# EAGLE schematic midi2cv (EAGLE 9.6.1)
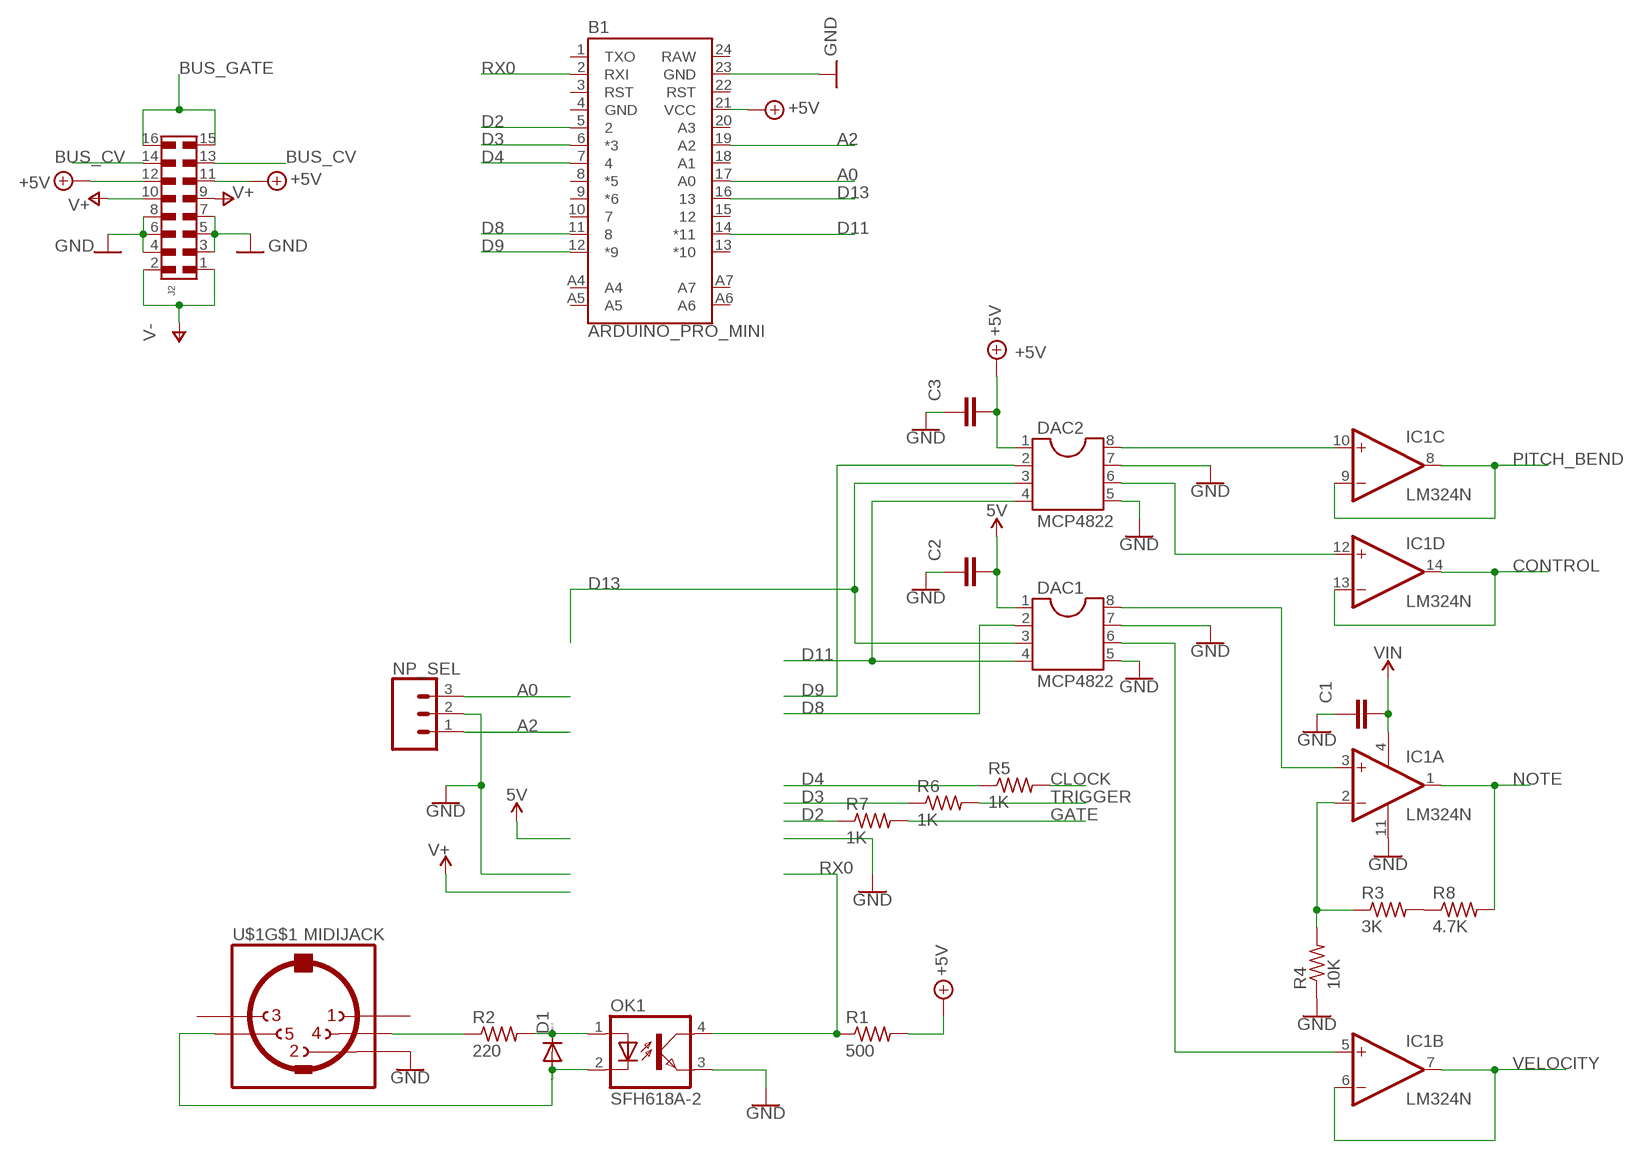
[diagram p0: schematic, sheet 1]

## Parts
B1  ARDUINO_PRO_MINI  [ARDUINO_PRO_MINI]
C1  0.1uF  C2.5/4  [C2.5-4]
C2  0.1uF  C2.5/4  [C2.5-4]
C3  0.1uF  C2.5/4  [C2.5-4]
D1  DIODE-D-10  [D-10]
DAC1  MCP4822  DIL8S  [SOCKET-08]
DAC2  MCP4822  DIL8S  [SOCKET-08]
IC1  LM324N  [DIL14]
J2  6120XX20621_61201620621  [61201620621]
NP_SEL  CONN_03  [1X03]
OK1  SFH618A-2  [DIP4]
R1  500  R-US_0207/10  [0207/10]
R2  220  R-US_0207/10  [0207/10]
R3  3K  R-US_0207/10  [0207/10]
R4  10K  R-US_0207/10  [0207/10]
R5  1K  R-US_0207/10  [0207/10]
R6  1K  R-US_0207/10  [0207/10]
R7  1K  R-US_0207/10  [0207/10]
R8  4.7K  R-US_0207/10  [0207/10]
U$1  MIDIJACK  [CP-2350]

## Nets
+5V: B1.21(VCC) C2.2 C3.2 DAC1.1 DAC2.1 J2.11 J2.12 R1.2 ; supply symbol labelled 5V
A0: B1.17(A0) NP_SEL.3
A2: B1.19(A2) NP_SEL.1
BUS_CV: J2.13 J2.14
BUS_GATE: J2.15 J2.16
CLOCK: R5.2
CONTROL: IC1.13(D:-IN) IC1.14(D:OUT)
D2: B1.5 R7.1
D3: B1.6(*3) R6.1
D4: B1.7 R5.1
D8: B1.11 DAC1.2
D9: B1.12(*9) DAC2.2
D11: B1.14(*11) DAC1.4 DAC2.4
D13: B1.16 DAC1.3 DAC2.3
GATE: R7.2
GND: B1.23(GND) C1.1 C2.1 C3.1 DAC1.5 DAC1.7 DAC2.5 DAC2.7 IC1.11(P:V-) J2.3 J2.4 J2.5 J2.6 J2.7 J2.8 NP_SEL.2 OK1.3(EMIT) R4.1 U$1.2
N$1: D1.C OK1.1(A) R2.2
N$2: D1.A OK1.2(C) U$1.5
N$3: R2.1 U$1.4
N$4: DAC1.8 IC1.3(A:+IN)
N$5: R3.2 R8.1
N$6: IC1.2(A:-IN) R3.1 R4.2
N$7: DAC1.6 IC1.5(B:+IN)
N$8: DAC2.8 IC1.10(C:+IN)
N$9: DAC2.6 IC1.12(D:+IN)
NOTE: IC1.1(A:OUT) R8.2
PITCH_BEND: IC1.8(C:OUT) IC1.9(C:-IN)
RX0: B1.2(RXI) OK1.4(COL) R1.1
TRIGGER: R6.2
V+: C1.2 IC1.4(P:V+) J2.9 J2.10 ; supply symbol labelled VIN
V-: J2.1 J2.2
VELOCITY: IC1.6(B:-IN) IC1.7(B:OUT)
Unconnected: B1.1(TXO) B1.3(RST) B1.8(*5) B1.9(*6) B1.10 B1.13(*10) B1.15 B1.18(A1) B1.20(A3) B1.22(RST) B1.A4 B1.A5 B1.A6 B1.A7 U$1.1 U$1.3 U$1.PE1(MT) U$1.PE2(MT) U$1.PE(MT) U$1.PE@(MT)

## Power pins joined to a net without a drawn wire
GND: B1.4(GND)
RAW: B1.24(RAW)

## Library data of the parts
B1 = SparkFun-Boards:ARDUINO_PRO_MINI: SparkFun Pro Mini Pro Mini compatible footprint. Dimensions: 0.7 x 1.3" PCB Thickness: 0.8mm SparkFun Products: 3.3V/8MHz <https://www.sparkfun.com/products/11114> 5V/16MHz <https://www.sparkfun.com/products/11113>
C1-C3 = capacitor-wima:C: CAPACITOR naming: grid - package width
D1 = diode:DIODE-: DIODE
DAC1 DAC2 = ic-package:DIL8: Dual In Line / Socket
IC1 = linear:LM324: OP AMP
J2 = Wurth_Connectors_WR-BHD:6120XX20621_61201620621: WR-BHD 2.54 mm Male SMT Box Header KIND PROPERTIES: Pitch 2.54 mm Gender:Male MATERIAL PROPERTIES: Insulator Material:PA6T Insulator Flammability Rating UL94 V-0 Insulator Color:Black Contact Material :Copper Alloy Contact Plating :Gold Contact Type: Stamped GENERAL INFORMATION: Operating Temperature:-40 °C up to +125 °C Compliance:RoHS Working Voltage: 250 V (AC) Withstanding Voltage:500 V (AC) Contact Resistance: 20 mΩ Insulation Resistance:1000 MΩ CERTIFICATION: UL Approval:E323964 PACKAGING PROPERTIES Packaging :Tube <https://katalog.we-online.com/media/images/v2/o32919v209%20Family_WR-BHD_612xxx20621.jpg> Details see: https://katalog.we-online.com/en/em/BHD_2_54_SMT_MALE_BOX_HEADER_6120XX20621 Updated by Yingchun,Shan 2019-10-30 2019 (C) Würth Elektronik; CONTACT-RESISTANCE: 20mOhm; DATASHEET-URL: https://katalog.we-online.com/em/datasheet/61201620621.pdf; GENDER: Male; IR: 3A; L: 28.12mm; MOUNT: SMT; PACKAGING: Tube; PART-NUMBER: 61201620621; PINS: 16; PITCH: 2.54mm; TOL-R: max.; TYPE: Straight; WORKING-VOLTAGE: 250V(AC)
NP_SEL = SparkFun-Connectors:CONN_03: Multi connection point. Often used as Generic Header-pin footprint for 0.1 inch spaced/style header connections On any of the 0.1 inch spaced packages, you can populate with these: Break Away Headers - Straight <https://www.sparkfun.com/products/116> (PRT-00116) Break Away Male Headers - Right Angle <https://www.sparkfun.com/products/553> (PRT-00553) Female Headers <https://www.sparkfun.com/products/115> (PRT-00115) Break Away Headers - Machine Pin <https://www.sparkfun.com/products/117> (PRT-00117) Break Away Female Headers - Swiss Machine Pin <https://www.sparkfun.com/products/743> (PRT-00743) Stackable Header - 3 Pin (Female, 0.1") <https://www.sparkfun.com/products/13875> (PRT-13875) For SCREWTERMINALS and SPRING TERMINALS visit here: Screw Terimnals on SparkFun.com <https://www.sparkfun.com/search/results?term=Screw+Terminals> (5mm/3.5mm/2.54mm spacing) This device is also useful as a general connection point to wire up your design to another part of your project. Our various solder wires solder well into these plated through hole pads. Hook-Up Wire - Assortment (Stranded, 22 AWG) <https://www.sparkfun.com/products/11375> (PRT-11375) Hook-Up Wire - Assortment (Solid Core, 22 AWG) <https://www.sparkfun.com/products/11367> (PRT-11367) View the entire wire category on our website here <https://www.sparkfun.com/categories/141> Special notes: Molex polarized connector foot print use with SKU : PRT-08232 with associated crimp pins and housings.
OK1 = optocoupler:SFH618?*: Optocoupler, Phototransistor Output, Low Input Current Source: Data sheet <http://www.vishay.com/docs/83673/sfh618.pdf>; MF: VISHAY/TELEFUNKEN; MPN: SFH618A-2; OC_FARNELL: 6424855; OC_NEWARK: 21H7744
R1-R8 = resistor:R-US_: RESISTOR, American symbol
U$1 = adafruit:MIDIJACK: DIN 5 jack also known as MIDI jack A modification of conn-hirshman:MAB5SH with two options for the grounding 'teeth'